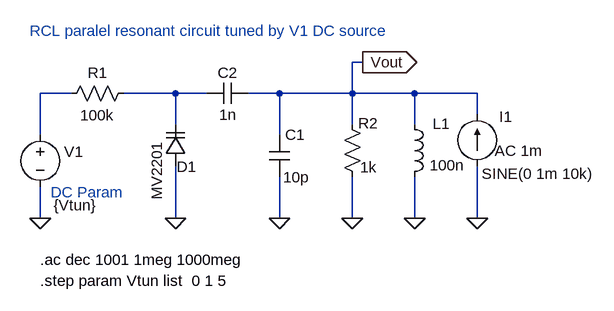
[diagram p0: schematic Varicap.asc]
Varicap.asc, the LTspice schematic file:
Version 4
SHEET 1 936 680
WIRE 544 -16 528 -16
WIRE 96 32 48 32
WIRE 256 32 176 32
WIRE 304 32 256 32
WIRE 416 32 368 32
WIRE 528 32 528 -16
WIRE 528 32 416 32
WIRE 624 32 528 32
WIRE 720 32 624 32
WIRE 720 64 720 32
WIRE 256 80 256 32
WIRE 528 80 528 32
WIRE 624 80 624 32
WIRE 48 96 48 32
WIRE 416 96 416 32
WIRE 48 224 48 176
WIRE 256 224 256 144
WIRE 416 224 416 160
WIRE 528 224 528 160
WIRE 624 224 624 160
WIRE 720 224 720 144
FLAG 48 224 0
FLAG 416 224 0
FLAG 528 224 0
FLAG 720 224 0
FLAG 624 224 0
FLAG 256 224 0
FLAG 544 -16 Vout
IOPIN 544 -16 Out
SYMBOL voltage 48 80 R0
WINDOW 123 0 0 Left 2
WINDOW 39 0 0 Left 2
WINDOW 0 37 42 Left 2
WINDOW 3 21 124 Left 2
SYMATTR InstName V1
SYMATTR Value {Vtun}
SYMBOL res 512 64 R0
WINDOW 0 25 14 Left 2
WINDOW 3 28 82 Left 2
SYMATTR InstName R2
SYMATTR Value 1k
SYMBOL cap 400 96 R0
WINDOW 0 25 0 Left 2
WINDOW 3 22 65 Left 2
SYMATTR InstName C1
SYMATTR Value 10p
SYMBOL ind 608 64 R0
WINDOW 0 44 15 Left 2
WINDOW 3 39 79 Left 2
SYMATTR InstName L1
SYMATTR Value 100n
SYMBOL current 720 144 R180
WINDOW 0 -54 76 Left 2
WINDOW 3 -7 -12 Right 2
WINDOW 123 -101 24 Left 2
WINDOW 39 0 0 Left 2
SYMATTR InstName I1
SYMATTR Value SINE(0 1m 10k)
SYMATTR Value2 AC 1m
SYMBOL cap 368 16 R90
WINDOW 0 0 32 VBottom 2
WINDOW 3 33 31 VTop 2
SYMATTR InstName C2
SYMATTR Value 1n
SYMBOL res 192 16 R90
WINDOW 0 0 56 VBottom 2
WINDOW 3 34 56 VTop 2
SYMATTR InstName R1
SYMATTR Value 100k
SYMBOL varactor 272 144 R180
WINDOW 0 -17 -1 Left 2
WINDOW 3 45 -52 VRight 2
SYMATTR InstName D1
SYMATTR Value MV2201
TEXT 48 288 Left 2 !.ac dec 1001 1meg 1000meg
TEXT 48 320 Left 2 !.step param Vtun list  0 1 5
TEXT 64 184 Left 2 ;DC Param
TEXT 32 -64 Left 2 ;RCL paralel resonant circuit tuned by V1 DC source

The netlist it stands for:
* Varicap.asc
V1 N001 0 {Vtun}
R2 Vout 0 1k
C1 Vout 0 10p
L1 Vout 0 100n
I1 0 Vout SINE(0 1m 10k) AC 1m
C2 Vout N002 1n
R1 N002 N001 100k
D1 0 N002 MV2201
.model D D
.lib standard.dio
.ac dec 1001 1meg 1000meg
.step param Vtun list  0 1 5
* DC Param
* RCL paralel resonant circuit tuned by V1 DC source
.backanno
.end